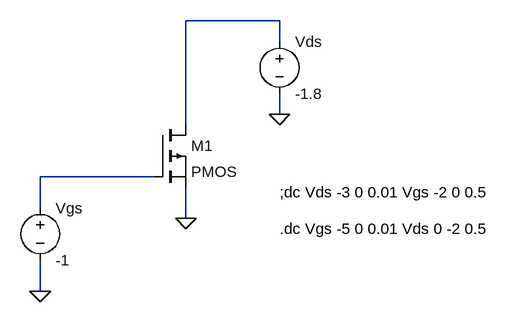
[diagram p0: schematic PMOS ytb.asc]
PMOS ytb.asc, the LTspice schematic file:
Version 4
SHEET 1 880 680
WIRE 336 -16 192 -16
WIRE 336 16 336 -16
WIRE 336 128 336 96
WIRE 192 144 192 -16
WIRE 144 224 -32 224
WIRE -32 272 -32 224
WIRE 192 288 192 240
WIRE -32 400 -32 352
FLAG 336 128 0
FLAG 192 288 0
FLAG -32 400 0
SYMBOL pmos 144 144 R0
SYMATTR InstName M1
SYMBOL voltage 336 0 R0
WINDOW 123 0 0 Left 0
WINDOW 39 0 0 Left 0
SYMATTR InstName Vds
SYMATTR Value -1.8
SYMBOL voltage -32 256 R0
WINDOW 123 0 0 Left 0
WINDOW 39 0 0 Left 0
SYMATTR InstName Vgs
SYMATTR Value -1
TEXT 336 248 Left 2 !;dc Vds -3 0 0.01 Vgs -2 0 0.5
TEXT 336 304 Left 2 !.dc Vgs -5 0 0.01 Vds 0 -2 0.5

The netlist it stands for:
* PMOS ytb.asc
M1 N001 N002 0 0 PMOS
Vds N001 0 -1.8
Vgs N002 0 -1
.model NMOS NMOS
.model PMOS PMOS
.lib standard.mos
;dc Vds -3 0 0.01 Vgs -2 0 0.5
.dc Vgs -5 0 0.01 Vds 0 -2 0.5
.backanno
.end